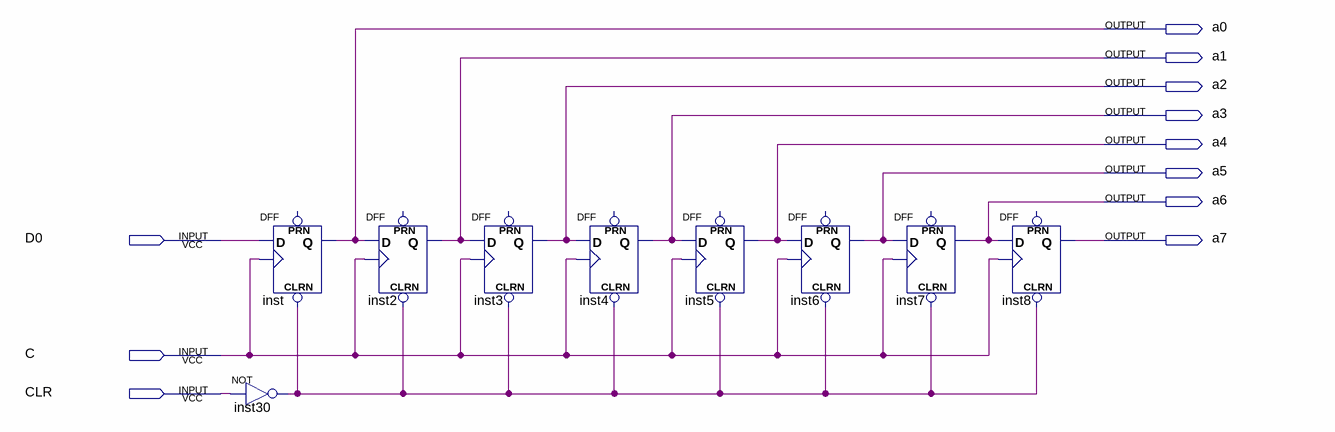
[diagram p0: schematic sheet]
// Quartus schematic Lab1RgstrSdv.bdf as structural Verilog: 9 symbols, 11 pins
module Lab1RgstrSdv (
  input  D0,
  input  C,
  input  CLR,
  output a0,
  output a1,
  output a2,
  output a3,
  output a4,
  output a5,
  output a6,
  output a7
);

  wire inst30_out;

  DFF inst (.CLRN(inst30_out), .CLK(C), .D(D0), .Q(a0));  // open: PRN
  not inst30 (inst30_out, CLR);
  DFF inst2 (.CLRN(inst30_out), .CLK(C), .D(a0), .Q(a1));  // open: PRN
  DFF inst3 (.CLRN(inst30_out), .CLK(C), .D(a1), .Q(a2));  // open: PRN
  DFF inst4 (.CLRN(inst30_out), .CLK(C), .D(a2), .Q(a3));  // open: PRN
  DFF inst5 (.CLRN(inst30_out), .CLK(C), .D(a3), .Q(a4));  // open: PRN
  DFF inst6 (.CLRN(inst30_out), .CLK(C), .D(a4), .Q(a5));  // open: PRN
  DFF inst7 (.CLRN(inst30_out), .CLK(C), .D(a5), .Q(a6));  // open: PRN
  DFF inst8 (.CLRN(inst30_out), .CLK(C), .D(a6), .Q(a7));  // open: PRN
endmodule
